# EAGLE design avr_ring2_v1.1 (EAGLE 9.6.2)
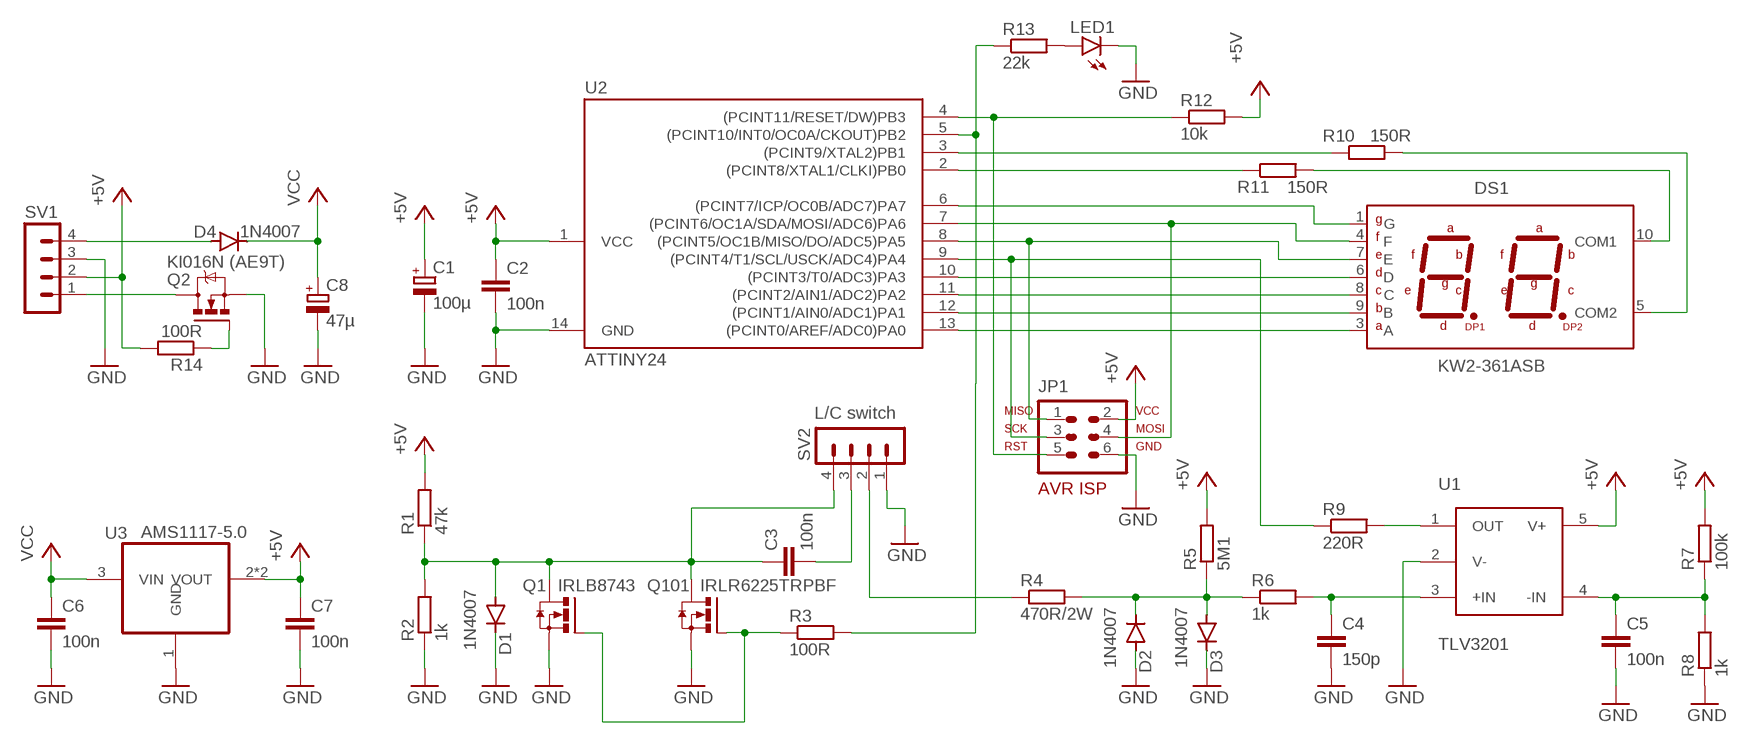
[diagram p0: schematic, sheet 1]

## Parts
C1  100µ  CPOL-EUE2.5-5  [E2,5-5]
C2  100n  C-EUC1206  [C1206]
C3  100n  C-EU102_152-062X184  [C102_152-062X184]
C4  150p  C-EUC1206  [C1206]
C5  100n  C-EUC1206  [C1206]
C6  100n  C-EUC1206  [C1206]
C7  100n  C-EUC1206  [C1206]
C8  47µ  CPOL-EUE2.5-5  [E2,5-5]
D1  1N4007  DIODE-DO214AC  [DO214AC]
D2  1N4007  DIODE-DO214AC  [DO214AC]
D3  1N4007  DIODE-DO214AC  [DO214AC]
D4  1N4007  DIODE-DO214AC  [DO214AC]
DS1  KW2-361ASB  DA03-11SUR-GA  [DA03-11SURKWA]
JP1  AVR-ISP  AVR-ISP-6VERT  [AVR-ISP-6]
LED1  LED3MM  [LED3MM]
Q1  IRLB8743  IRF3704  [TO220AH]
Q2  KI016N (AE9T)  NMOSFET_SOT23-GSD  [SOT23]
Q101  IRLR6225TRPBF  [TO-252-3]
R1  47k  R-EU_R1206  [R1206]
R2  1k  R-EU_R1206  [R1206]
R3  100R  R-EU_R1206  [R1206]
R4  470R/2W  R-EU_0414/15  [0414/15]
R5  5M1  R-EU_R1206  [R1206]
R6  1k  R-EU_R1206  [R1206]
R7  100k  R-EU_R1206  [R1206]
R8  1k  R-EU_R1206  [R1206]
R9  220R  R-EU_R1206  [R1206]
R10  150R  R-EU_R1206  [R1206]
R11  150R  R-EU_R1206  [R1206]
R12  10k  R-EU_R1206  [R1206]
R13  22k  R-EU_R1206  [R1206]
R14  100R  R-EU_R1206  [R1206]
SV1  MA04-1  [MA04-1]
SV2  L/C switch  MA04-1  [MA04-1]
U1  TLV3201  OPA333AIDBVT  [SOT-23-5]
U2  ATTINY24  TINY24/44/84-SSU  [SOIC14]
U3  AMS1117-5.0  REG1117  [SOT223]

## Nets
+5V: C1.+ C2.1 C7.1 JP1.2 R1.2 R5.2 R7.2 R12.2 R14.2 SV1.2 U1.5(V+) U2.1(VCC) U3.2(VOUT) U3.4(VOUT)
GND: C1.- C2.2 C4.2 C5.2 C6.2 C7.2 C8.- D1.C D2.A D3.C JP1.6 LED1.K(C) Q1.E(S) Q2.2(S) Q101.2(S) R2.1 R8.1 SV1.3 SV2.1 U1.2(V-) U2.14(GND) U3.1(GND)
N$1: R11.1 U2.2((PCINT8/XTAL1/CLKI)PB0)
N$2: R10.1 U2.3((PCINT9/XTAL2)PB1)
N$3: DS1.10(COM1) R11.2
N$4: DS1.5(COM2) R10.2
N$5: DS1.3(A) U2.13((PCINT0/AREF/ADC0)PA0)
N$6: DS1.9(B) U2.12((PCINT1/AIN0/ADC1)PA1)
N$7: DS1.8(C) U2.11((PCINT2/AIN1/ADC2)PA2)
N$8: DS1.6(D) U2.10((PCINT3/T0/ADC3)PA3)
N$9: DS1.7(E) JP1.1 U2.8((PCINT5/OC1B/MISO/DO/ADC5)PA5)
N$10: DS1.4(F) JP1.4 U2.7((PCINT6/OC1A/SDA/MOSI/ADC6)PA6)
N$11: DS1.1(G) U2.6((PCINT7/ICP/OC0B/ADC7)PA7)
N$12: JP1.3 R9.1 U2.9((PCINT4/T1/SCL/USCK/ADC4)PA4)
N$13: R9.2 U1.1(OUT)
N$14: C5.1 R7.1 R8.2 U1.4(-IN)
N$15: C4.1 R6.2 U1.3(+IN)
N$16: D2.C D3.A R4.2 R5.1 R6.1
N$17: JP1.5 R12.1 U2.4((PCINT11/RESET/DW)PB3)
N$18: Q1.B(G) Q101.1(G) R3.1
N$19: LED1.A R13.2
N$20: D4.A SV1.4
N$21: C3.2 C3.3 SV2.3
N$22: R4.1 SV2.2
N$23: C3.1 D1.A Q1.C(D) Q101.3(D) R1.1 R2.2 SV2.4
N$24: R3.2 R13.1 U2.5((PCINT10/INT0/OC0A/CKOUT)PB2)
N$25: Q2.3(D) SV1.1
N$27: Q2.1(G) R14.1
VCC: C6.1 C8.+ D4.C U3.3(VIN)

## Library data of the parts
C1 C8 = rcl-custom:CPOL-EU: POLARIZED CAPACITOR, European symbol; SPICEPREFIX: C
C2-C7 = rcl-custom:C-EU: CAPACITOR, European symbol; SPICEPREFIX: C
D1-D4 = diode-custom:DIODE-: DIODE
DS1 = Display_LED-custom:DA03-11SUR-GA: Dual Digit Numeric Display - 7SEG, 0.3" Character size, RED, 10DIP, THT Datasheet <https://www.kingbrightusa.com/images/catalog/SPEC/DA03-11SURKWA.pdf>; CATEGORY: DISPLAY; COLOR: Hyper Red (AlGaInP); CONFIGURATION: Common Anode; DESCRIPTION: 7.62 mm (0.3 inch) Dual Digit Numeric Display; DIGIT: Dual Digit; MANUFACTURER: Kingbright; MPN: DA03-11SURKWA; OPERATING_TEMP: -40°C to +85 °C; PART_STATUS: Active; ROHS_COMPLIANT: COMPLIANT; SERIES: -; SUB-CATEGORY: LED; THERMALLOSS: 0.075 W; TYPE: 7 Segment
JP1 = avr-7-custom:AVR-ISP-6: AVR ISP-6 Serial Programming Header
LED1 = led-custom:LED: LED OSRAM: - CHIPLED LG R971, LG N971, LY N971, LG Q971, LY Q971, LO R971, LY R971 LH N974, LH R974 LS Q976, LO Q976, LY Q976 LO Q996 - Hyper CHIPLED LW Q18S LB Q993, LB Q99A, LB R99A - SideLED LS A670, LO A670, LY A670, LG A670, LP A670 LB A673, LV A673, LT A673, LW A673 LH A674 LY A675 LS A676, LA A676, LO A676, LY A676, LW A676 LS A679, LY A679, LG A679 - Hyper Micro SIDELED® LS Y876, LA Y876, LO Y876, LY Y876 LT Y87S - SmartLED LW L88C, LW L88S LB L89C, LB L89S, LG L890 LS L89K, LO L89K, LY L89K LS L896, LA L896, LO L896, LY L896 - TOPLED LS T670, LO T670, LY T670, LG T670, LP T670 LSG T670, LSP T670, LSY T670, LOP T670, LYG T670 LG T671, LOG T671, LSG T671 LB T673, LV T673, LT T673, LW T673 LH T674 LS T676, LA T676, LO T676, LY T676, LB T676, LH T676, LSB T676, LW T676 LB T67C, LV T67C, LT T67C, LS T67K, LO T67K, LY T67K, LW E67C LS E67B, LA E67B, LO E67B, LY E67B, LB E67C, LV E67C, LT E67C LW T67C LS T679, LY T679, LG T679 LS T770, LO T770, LY T770, LG T770, LP T770 LB T773, LV T773, LT T773, LW T773 LH T774 LS E675, LA E675, LY E675, LS T675 LS T776, LA T776, LO T776, LY T776, LB T776 LHGB T686 LT T68C, LB T68C - Hyper Mini TOPLED® LB M676 - Mini TOPLED Santana® LG M470 LS M47K, LO M47K, LY M47K Source: http://www.osram.convergy.de LUXEON: - LUMILED® LXK2-PW12-R00, LXK2-PW12-S00, LXK2-PW14-U00, LXK2-PW14-V00 LXK2-PM12-R00, LXK2-PM12-S00, LXK2-PM14-U00 LXK2-PE12-Q00, LXK2-PE12-R00, LXK2-PE12-S00, LXK2-PE14-T00, LXK2-PE14-U00 LXK2-PB12-K00, LXK2-PB12-L00, LXK2-PB12-M00, LXK2-PB14-N00, LXK2-PB14-P00, LXK2-PB14-Q00 LXK2-PR12-L00, LXK2-PR12-M00, LXK2-PR14-Q00, LXK2-PR14-R00 LXK2-PD12-Q00, LXK2-PD12-R00, LXK2-PD12-S00 LXK2-PH12-R00, LXK2-PH12-S00 LXK2-PL12-P00, LXK2-PL12-Q00, LXK2-PL12-R00 Source: www.luxeon.com KINGBRIGHT: KA-3528ASYC Source: www.kingbright.com
Q1 = transistor-power:IRF3704: SMPS MOSFET HEXFET® Power MOSFET Source: http://www.irf.com/product-info/datasheets/data/irf3704.pdf
Q2 = Transistor-fusion-custom:NMOSFET: N-Channel MOSFET - Generic; CATEGORY: Transistor; SUB-CATEGORY: MOSFET; TYPE: N-Channel; VALUE: NMOSFET
Q101 = IRLR6225TRPBF:IRLR6225TRPBF
R1-R14 = rcl-custom:R-EU_: RESISTOR, European symbol; SPICEPREFIX: R
SV1 SV2 = con-lstb:MA04-1: PIN HEADER; OC_FARNELL: unknown; OC_NEWARK: unknown
U1 = IC:OPA333AIDBVT: IC OPAMP ZER-DRIFT 1CIRC SOT23-5 Manufacturer's datasheet <http://www.ti.com/general/docs/suppproductinfo.tsp?distId=10&gotoUrl=http%3A%2F%2Fwww.ti.com%2Flit%2Fgpn%2Fopa333>; CREATED: PCBLayout.com; DIGIKEY_PART_NUMBER: 296-19546-1-ND; MANUFACTURER: Texas Instruments; MPN: OPA333AIDBVT; PACKAGE: SOT-23-5
U2 = avr-7-custom:TINY24/44/84
U3 = burr-brown-custom:REG1117: 800mA and 1A Low Dropout (LDO) Positive Regulator 1.8V, 2.5V, 2.85V, 3.3V, 5V, and Adj; MPN: REG1117; OC_FARNELL: 1097566; OC_NEWARK: 14P6981

## Board
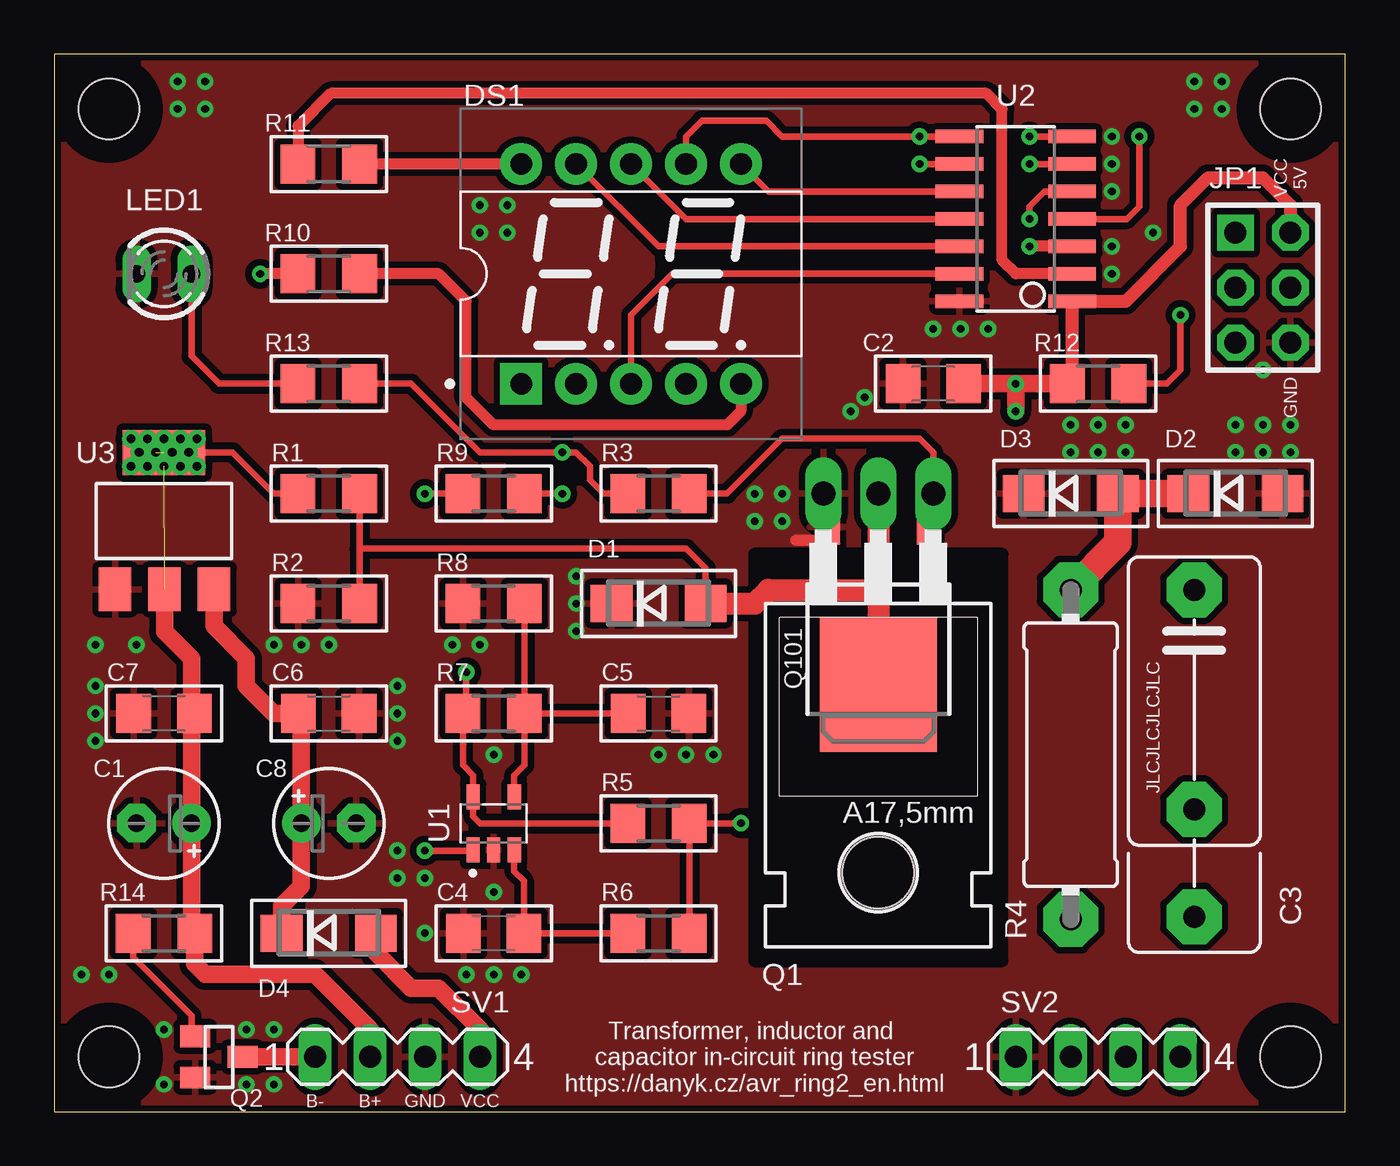
[diagram p1: board, top side]
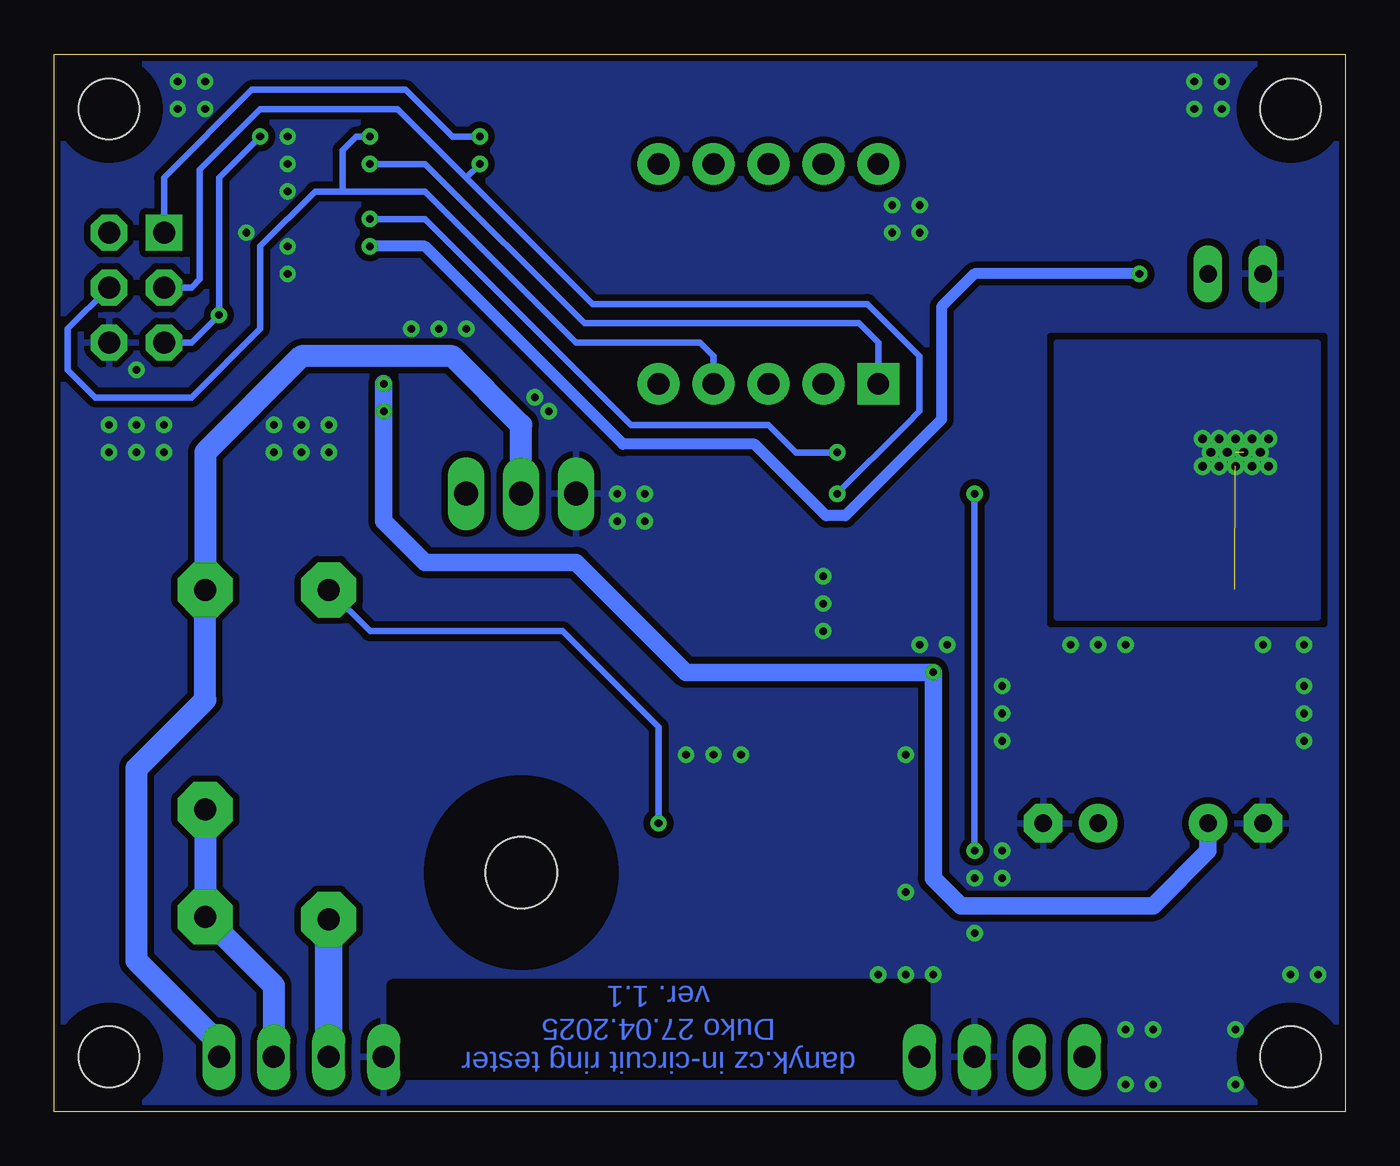
[diagram p2: board, bottom side, seen from below]

Size 59.69 x 48.89 mm. Coordinates in mm from the lower left corner, seen from the top.
Outline: 0,0 59.69,0 59.69,48.89 0,48.88 0,0
Copper layers (1*16): Top 0.035mm / dielectric 1.5mm / Bottom 0.035mm
Design rules "default *": minimum track width 6mil, minimum drill 0.35mm, track to track 6mil, track to pad 6mil, pad to pad 6mil, via to via 6mil, smd to smd 6mil, copper to edge 12mil, drill to drill 6mil, minimum pad ring 10mil, minimum via ring 8mil, stop-mask expansion 4mil, vias tented up to drill 14mil, thermal gap 12mil
Holes 2.79 mm at 2.54,2.54 57.15,2.54 2.54,46.35 57.15,46.35
tRestrict: area 32.4,7 to 43.8,25.8; area 0.8,0.8 to 4.3,4.3; area 55.4,0.8 to 58.9,4.3; area 0.8,44.6 to 4.3,48.1; area 55.4,44.6 to 58.9,48.1; area 28.1,38.9 to 28.4,39.4
bRestrict: area 55.4,0.8 to 58.9,4.3; area 0.8,44.6 to 4.3,48.1; area 55.4,44.6 to 58.9,48.1; area 0.8,0.8 to 4.3,4.3

### Footprints (pad centres in the part's own frame; a part is rotated, then mirrored left to right if it is on the bottom)
E2,5-5 = drill 0.813 pad 1.778: + -1.27,0 | drill 0.813 pad 1.778 octagon: - 1.27,0
C1206 = smd 1.6 x 1.8: 1 -1.4,0; 2 1.4,0
C102_152-062X184 = drill 1.016 pad 2.54 octagon: 1 -5.08,0; 2 5.08,0; 3 10.033,0
DO214AC = smd 1.927 x 1.7: A 2.177,0; C -2.177,0
DA03-11SURKWA = drill 1 pad 1.93 square: 1 -5.08,5.08 | drill 1 pad 1.93: 2 -5.08,2.54; 3 -5.08,0; 4 -5.08,-2.54; 5 -5.08,-5.08; 6 5.08,-5.08; 7 5.08,-2.54; 8 5.08,0; 9 5.08,2.54; 10 5.08,5.08
AVR-ISP-6 = drill 1.016 pad 1.676 square: 1 -2.54,-1.27 | drill 1.016 pad 1.676 octagon: 2 -2.54,1.27; 3 0,-1.27; 4 0,1.27; 5 2.54,-1.27; 6 2.54,1.27
LED3MM = drill 0.813 long: A -1.27,0; K 1.27,0
TO220AH = drill 1.118 long: B -2.54,-6.35; C 0,-6.35; E 2.54,-6.35 | hole 3.302: 0,11.176
SOT23 = smd 1 x 1.4: 1 -0.95,-1.1; 2 0.95,-1.1; 3 0,1.1
TO-252-3 = smd 1 x 1.6: 1 -2.28,-4.8; 2 2.28,-4.8 | smd 5.4 x 6.2: 3 0,2.5
R1206 = smd 1.6 x 1.803: 1 -1.422,0; 2 1.422,0
0414/15 = drill 1.016 pad 2.54 octagon: 1 -7.62,0; 2 7.62,0
MA04-1 = drill 1.016 long: 1 -3.81,0; 2 -1.27,0; 3 1.27,0; 4 3.81,0
SOT-23-5 = smd 1.16 x 0.61: 1 -1.23,0.95; 2 -1.23,0; 3 -1.23,-0.95; 4 1.23,-0.95; 5 1.23,0.95
SOIC14 = smd 0.61 x 2.21: 1 -3.81,-2.603; 2 -2.54,-2.603; 3 -1.27,-2.603; 4 0,-2.603; 5 1.27,-2.603; 6 2.54,-2.603; 7 3.81,-2.603; 8 3.81,2.603; 9 2.54,2.603; 10 1.27,2.603; 11 0,2.603; 12 -1.27,2.603; 13 -2.54,2.603; 14 -3.81,2.603
SOT223 = smd 1.499 x 2.007: 1 -2.261,-3.15; 2 0.025,-3.15; 3 2.311,-3.15 | smd 3.81 x 2.083: 4 0,3.175

### Placement (x,y rotation side)
C1  5.08,13.33 180 top
C2  40.64,33.66 180 top
C3  52.7,19.05 270 top
C4  20.32,8.26 180 top
C5  27.94,18.42 0 top
C6  12.7,18.42 0 top
C7  5.08,18.42 180 top
C8  12.7,13.33 0 top
D1  27.94,23.5 0 top
D2  54.61,28.58 0 top
D3  46.99,28.58 0 top
D4  12.7,8.26 0 top
DS1  26.67,38.73 90 top
JP1  55.88,38.1 270 top
LED1  5.08,38.73 180 top
Q1  38.1,22.23 180 top
Q2  7.62,2.54 270 top
Q101  38.1,22.23 180 top
R1  12.7,28.58 180 top
R2  12.7,23.5 0 top
R3  27.94,28.58 180 top
R4  46.99,16.51 90 top
R5  27.94,13.33 180 top
R6  27.94,8.26 180 top
R7  20.32,18.42 180 top
R8  20.32,23.5 0 top
R9  20.32,28.58 180 top
R10  12.7,38.73 0 top
R11  12.7,43.81 0 top
R12  48.26,33.66 180 top
R13  12.7,33.66 180 top
R14  5.08,8.26 0 top
SV1  15.88,2.54 0 top
SV2  48.26,2.54 0 top
U1  20.32,13.33 90 top
U2  44.45,41.27 90 top
U3  5.08,27.31 0 top

### Tracks (layer width: path | path; a pad name or v marks a point on that pad's centre or on a via)
+5V  (via drill 0.35, 0.4)  (2 unrouted)
  Top 0.305: 47.05,33.87 R12.2 | R5.2 19.68,13.33 19.37,13.65 U1.5 19.37,15.55 18.9,16.03 R7.2 19.05,18.57 v19.05,20.32 | R1.2 10.16,28.58 8.26,30.48 v4.7,30.48
  Top 0.61: 6.35,18.29 C7.1 | 47.05,33.87 U2.1 49.53,37.46 52.07,40 52.07,41.91 53.34,43.18 55.88,43.18 57.15,41.91 JP1.2
  Top 0.813: SV1.2 14.61,3.81 12.06,6.35 6.99,6.35 6.5,6.83 R14.2 6.35,8.41 C1.+ 6.35,18.29 6.35,20.96 5.11,22.2 U3.2 | C2.1 v44.45,33.66 | v44.45,33.66 R12.2 | v44.45,33.66 v44.45,32.38
  Bottom 0.813: v44.45,33.66 v44.45,32.38 44.45,27.31 42.55,25.4 35.56,25.4 30.48,20.32 v19.05,20.32 19.05,10.79 17.78,9.53 8.89,9.53 6.35,12.06 C1.+
  other vias: 3.56,31.12 3.56,29.85 4.32,31.12 3.94,30.48 4.32,29.85 5.08,29.85 5.08,31.12 5.84,31.12 6.6,31.12 5.46,30.48 5.84,29.85 6.6,29.85 6.22,30.48
  pour Bottom (isolate 0.305): 1.27,35.56 13.34,35.56 13.34,22.86 1.27,22.86
GND  (via drill 0.35)
  Top 0.305: Q1.E 35.82,28.32 Q101.2
  Top 0.508: Q101.2 35.21,26.42 34.29,26.42
  other vias: 48.9,45.09 48.9,43.81 48.9,42.54 55.88,34.29 15.88,19.69 15.88,17.15 1.91,19.69 1.91,17.15 20.32,6.35 17.14,8.26 40.64,36.2 36.83,32.38 27.94,16.51 30.48,16.51 24.13,24.77 24.13,22.23 43.18,36.2 48.9,40 55.88,31.75 57.15,31.75 54.61,31.75 1.91,21.59 3.81,21.59 19.68,41.91 20.95,41.91 19.68,40.64 20.95,40.64 33.66,28.58 48.26,31.75 49.53,31.75 46.99,31.75 20.32,16.51 18.41,21.59 19.68,21.59 33.66,27.31 48.9,38.73 50.8,40.64 21.59,6.35 1.91,18.42 15.88,18.42 24.13,23.5 32.38,27.31 32.38,28.58 29.21,16.51 54.61,30.48 55.88,30.48 57.15,30.48 46.99,30.48 48.26,30.48 49.53,30.48 1.27,6.35 2.54,6.35 5.08,1.27 5.08,3.81 8.89,1.27 8.89,3.81 41.91,36.2 52.7,47.62 53.98,47.62 53.98,46.35 52.7,46.35 10.16,21.59 11.43,21.59 12.7,21.59 17.14,10.79 15.88,10.79 15.88,12.06 20.32,10.16 5.71,47.62 5.71,46.35 6.99,46.35 6.99,47.62 37.47,33.02 10.16,1.27 10.16,3.81 19.05,6.35
  pour Bottom (isolate 0.305, rank 2): -0.64,49.53 -0.64,0 60.33,0 60.33,49.53
  pour Top (isolate 0.305): -1.27,50.8 -1.27,-1.27 61.59,-1.27 61.59,50.8
N$1
  Top 0.508: R11.1 11.28,45.57 12.79,47.08 43.09,47.09 43.81,46.35 43.81,39.37 44.45,38.73 U2.2
N$2  (via drill 0.35)
  Top 0.508: U2.3 v45.09,40 | R10.1 v9.53,38.73
  Bottom 0.508: v9.53,38.73 17.14,38.73 18.67,37.21 18.67,32 23.11,27.56 24,27.56 27.3,30.86 33.4,30.86 42.55,40 v45.09,40
N$3
  Top 0.508: DS1.10 R11.2
N$4
  Top 0.508: DS1.5 31.75,32.38 31.11,31.75 29.21,31.75 20.32,31.75 19.05,33.02 19.05,37.46 17.78,38.73 R10.2
N$5
  Top 0.305: U2.13 28.57,38.73 26.67,36.83 DS1.3
N$6
  Top 0.305: U2.12 27.94,40 DS1.9
N$7
  Top 0.305: U2.11 29.21,41.27 DS1.8
N$8
  Top 0.305: U2.10 33.02,42.54 DS1.6
N$9  (via drill 0.35)
  Top 0.305: U2.8 v40.01,45.09 33.66,45.09 32.92,45.82 29.94,45.82 29.21,45.09 DS1.7
  Bottom 0.305: v40.01,45.09 41.27,45.09 43.43,47.24 47.75,47.24 50.55,47.24 54.61,43.18 JP1.1
N$10  (via drill 0.35)
  Top 0.305: U2.7 v45.09,45.09
  Bottom 0.305: DS1.4 29.21,34.92 29.84,35.56 35.56,35.56 42.55,42.54 46.35,42.54 | JP1.4 59.05,36.2 59.05,34.29 57.78,33.02 53.34,33.02 50.16,36.2 50.16,40 47.62,42.54 46.35,42.54 | v45.09,45.09 45.72,45.09 46.35,44.45 46.35,42.54
N$11  (via drill 0.35)
  Top 0.305: U2.6 v45.09,43.81
  Bottom 0.305: v45.09,43.81 42.55,43.81 35.18,36.45 22.48,36.45 21.59,35.56 DS1.1
N$12  (via drill 0.35)
  Top 0.305: U2.9 v40.01,43.81 | v23.5,28.58 R9.1
  Bottom 0.305: v23.5,28.58 20.32,31.75 19.68,32.38 19.68,34.92 22.1,37.34 34.8,37.34 40.64,43.18 | JP1.3 53.34,38.1 52.96,38.48 52.96,43.56 50.16,46.35 43.81,46.35 40.64,43.18 | v40.01,43.81 40.64,43.18
N$13  (via drill 0.35)
  Top 0.305: R9.2 v17.14,28.58 | U1.1 19.33,12.06 v17.14,12.06
  Bottom 0.305: v17.14,28.58 v17.14,12.06
N$14
  Top 0.305: R7.1 C5.1 | U1.4 21.27,15.55 21.74,16.03 R7.1 | R8.2 R7.1
N$15
  Top 0.305: R6.2 C4.1 21.72,10.66 21.27,11.12 U1.3
N$16  (via drill 0.35)
  Top 0.305: R6.1 R5.1 v31.75,13.33
  Top 1.27: D2.C D3.A 49.17,26.31 R4.2
  Bottom 0.305: R4.2 45.09,22.23 36.2,22.23 31.75,17.78 v31.75,13.33
N$17  (via drill 0.35)
  Top 0.305: v50.16,45.09 50.16,41.85 49.59,41.27 U2.4 | v52.07,36.83 52.07,34.29 51.44,33.66 R12.1
  Bottom 0.305: v50.16,45.09 52.07,43.18 v52.07,36.83 53.34,35.56 JP1.5
N$18
  Top 0.305: R3.1 31.11,28.58 33.66,31.12 40.01,31.12 40.64,30.48 Q1.B 40.64,27.29 Q101.1
N$19
  Top 0.305: LED1.A 6.35,34.92 7.62,33.66 R13.2
N$20
  Top 0.813: SV1.4 19.68,3.81 17.78,5.71 16.51,5.71 14.88,7.35 D4.A
N$21
  Bottom 1.016: C3.2 C3.3 49.53,5.84 SV2.3
N$22
  Bottom 1.27: R4.1 SV2.2
N$23
  Top 0.305: R1.1 14.12,26.04 | 14.12,26.04 R2.2 | 14.12,26.04 29.21,26.04 30.12,25.13 D1.A
  Top 1.016: Q1.C 38.1,24.13 | 38.1,24.13 Q101.3 | D1.A 32.38,23.5 33.02,24.13 38.1,24.13
  Bottom 1.016: SV2.4 52.07,3.17 55.88,6.98 55.88,15.88 52.7,19.05 C3.1 52.7,30.48 48.26,34.92 41.27,34.92 38.1,31.75 Q1.C
N$24  (via drill 0.35)
  Top 0.305: U2.5 45.78,42.54 45.09,41.85 v45.09,41.27 | R13.1 16.51,33.66 19.68,30.48 23.34,30.48 v23.5,30.48 24.13,30.48 24.77,29.85 24.77,29.21 25.4,28.58 R3.2
  Bottom 0.305: v23.5,30.48 25.4,30.48 26.67,31.75 33.02,31.75 42.55,41.27 v45.09,41.27
N$25
  Top 0.813: Q2.3 SV1.1
N$27
  Top 0.305: Q2.1 6.35,3.66 6.35,4.45 3.66,7.14 R14.1
VCC
  Top 0.61: 11.43,18.42 C6.1
  Top 0.813: D4.C 10.52,9.53 11.43,10.43 C8.+ 11.43,18.42 10.16,18.42 8.89,19.69 8.89,20.96 7.39,22.45 U3.3

### Text on the board
Bottom: danyk.cz in-circuit ring tester / Duko 27.04.2025 / ver. 1.1
tNames: VCC / 5V | GND | JLCJLCJLCJLC | Transformer, inductor and / capacitor in-circuit ring tester / https://danyk.cz/avr_ring2_en.html | B- | B+ | GND | VCC